# EAGLE design programmer (EAGLE 6.5.0)
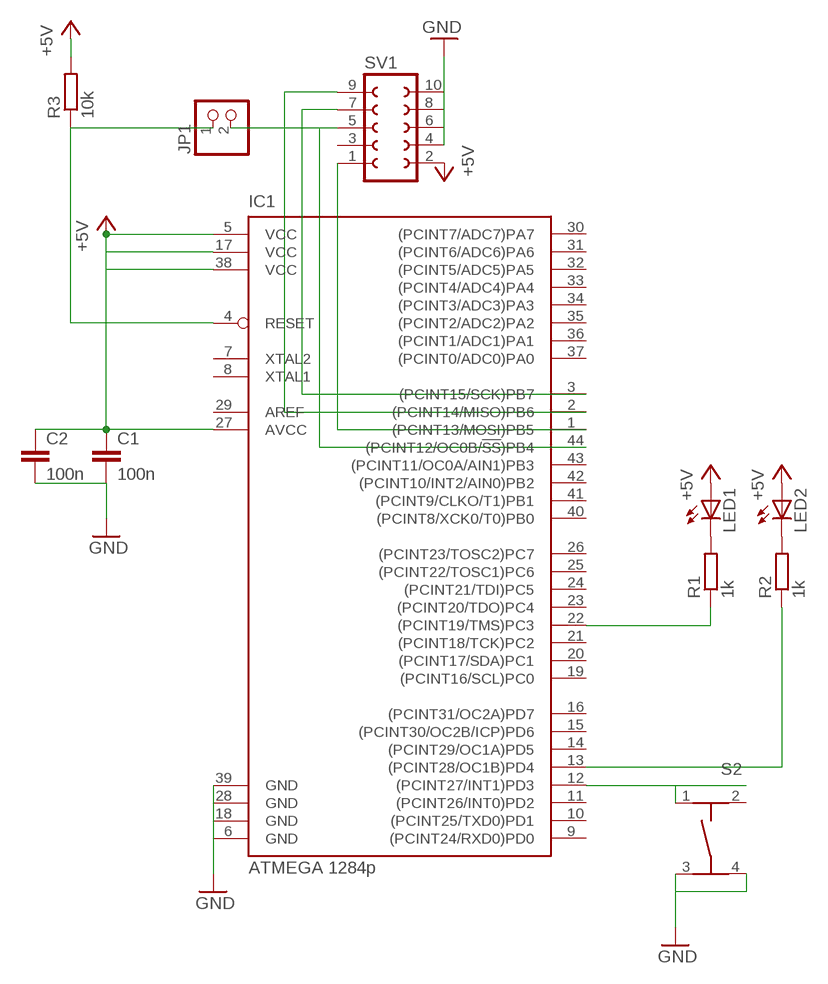
[diagram p0: schematic, sheet 1]

## Parts
C1  100n  C-EUC0603  [C0603]
C2  100n  C-EUC0603  [C0603]
IC1  ATMEGA 1284p  ATMEGA644A  [TQFP44]
JP1  PINHD-1X2  [1X02]
LED1  LED  [SMARTLED-TTW]
LED2  LED  [SMARTLED-TTW]
R1  1k  R-EU_R0603  [R0603]
R2  1k  R-EU_R0603  [R0603]
R3  10k  R-EU_R0603  [R0603]
S2  TASTER-9314_SMD  [TASTER-9314_SMD]
SV1  FE05-2W  [FE05-2W]

## Nets
+5V: C1.1 C2.1 IC1.5(VCC) IC1.17(VCC) IC1.27(AVCC) IC1.38(VCC) LED1.A@1(A) LED2.A@1(A) R3.2 SV1.2
GND: C1.2 C2.2 IC1.6(GND) IC1.18(GND) IC1.28(GND) IC1.39(GND) S2.3 S2.4 SV1.4 SV1.6 SV1.8 SV1.10
N$1: IC1.4(RESET) JP1.1 R3.1
N$2: IC1.44((PCINT12/OC0B/!SS!)PB4) JP1.2 SV1.5
N$3: LED1.C@1(C) R1.2
N$5: LED2.C@1(C) R2.2
N$6: IC1.3((PCINT15/SCK)PB7) SV1.7
N$7: IC1.1((PCINT13/MOSI)PB5) SV1.1
N$8: IC1.2((PCINT14/MISO)PB6) SV1.9
N$9: IC1.12((PCINT27/INT1)PD3) S2.1
N$12: IC1.22((PCINT19/TMS)PC3) R1.1
N$13: IC1.13((PCINT28/OC1B)PD4) R2.1
Unconnected: IC1.7(XTAL2) IC1.8(XTAL1) IC1.9((PCINT24/RXD0)PD0) IC1.10((PCINT25/TXD0)PD1) IC1.11((PCINT26/INT0)PD2) IC1.14((PCINT29/OC1A)PD5) IC1.15((PCINT30/OC2B/ICP)PD6) IC1.16((PCINT31/OC2A)PD7) IC1.19((PCINT16/SCL)PC0) IC1.20((PCINT17/SDA)PC1) IC1.21((PCINT18/TCK)PC2) IC1.23((PCINT20/TDO)PC4) IC1.24((PCINT21/TDI)PC5) IC1.25((PCINT22/TOSC1)PC6) IC1.26((PCINT23/TOSC2)PC7) IC1.29(AREF) IC1.30((PCINT7/ADC7)PA7) IC1.31((PCINT6/ADC6)PA6) IC1.32((PCINT5/ADC5)PA5) IC1.33((PCINT4/ADC4)PA4) IC1.34((PCINT3/ADC3)PA3) IC1.35((PCINT2/ADC2)PA2) IC1.36((PCINT1/ADC1)PA1) IC1.37((PCINT0/ADC0)PA0) IC1.40((PCINT8/XCK0/T0)PB0) IC1.41((PCINT9/CLKO/T1)PB1) IC1.42((PCINT10/INT2/AIN0)PB2) IC1.43((PCINT11/OC0A/AIN1)PB3) S2.2 SV1.3

## Library data of the parts
C1 C2 = rcl:C-EU: CAPACITOR, European symbol
IC1 = atmel:ATMEGA644: 8-bit Microcontroller with 64K Bytes In-System Programmable Flash Source: http://www.atmel.com/dyn/resources/prod_documents/doc2593.pdf; MPN: ATMEGA644PV-10AU; OC_FARNELL: 1455123; OC_NEWARK: 58M3748
JP1 = pinhead:PINHD-1X2: PIN HEADER
LED1 LED2 = led:LED: LED OSRAM: - CHIPLED LG R971, LG N971, LY N971, LG Q971, LY Q971, LO R971, LY R971 LH N974, LH R974 LS Q976, LO Q976, LY Q976 LO Q996 - Hyper CHIPLED LW Q18S LB Q993, LB Q99A, LB R99A - SideLED LS A670, LO A670, LY A670, LG A670, LP A670 LB A673, LV A673, LT A673, LW A673 LH A674 LY A675 LS A676, LA A676, LO A676, LY A676, LW A676 LS A679, LY A679, LG A679 - Hyper Micro SIDELED® LS Y876, LA Y876, LO Y876, LY Y876 LT Y87S - SmartLED LW L88C, LW L88S LB L89C, LB L89S, LG L890 LS L89K, LO L89K, LY L89K LS L896, LA L896, LO L896, LY L896 - TOPLED LS T670, LO T670, LY T670, LG T670, LP T670 LSG T670, LSP T670, LSY T670, LOP T670, LYG T670 LG T671, LOG T671, LSG T671 LB T673, LV T673, LT T673, LW T673 LH T674 LS T676, LA T676, LO T676, LY T676, LB T676, LH T676, LSB T676, LW T676 LB T67C, LV T67C, LT T67C, LS T67K, LO T67K, LY T67K, LW E67C LS E67B, LA E67B, LO E67B, LY E67B, LB E67C, LV E67C, LT E67C LW T67C LS T679, LY T679, LG T679 LS T770, LO T770, LY T770, LG T770, LP T770 LB T773, LV T773, LT T773, LW T773 LH T774 LS E675, LA E675, LY E675, LS T675 LS T776, LA T776, LO T776, LY T776, LB T776 LHGB T686 LT T68C, LB T68C - Hyper Mini TOPLED® LB M676 - Mini TOPLED Santana® LG M470 LS M47K, LO M47K, LY M47K Source: http://www.osram.convergy.de LUXEON: - LUMILED® LXK2-PW12-R00, LXK2-PW12-S00, LXK2-PW14-U00, LXK2-PW14-V00 LXK2-PM12-R00, LXK2-PM12-S00, LXK2-PM14-U00 LXK2-PE12-Q00, LXK2-PE12-R00, LXK2-PE12-S00, LXK2-PE14-T00, LXK2-PE14-U00 LXK2-PB12-K00, LXK2-PB12-L00, LXK2-PB12-M00, LXK2-PB14-N00, LXK2-PB14-P00, LXK2-PB14-Q00 LXK2-PR12-L00, LXK2-PR12-M00, LXK2-PR14-Q00, LXK2-PR14-R00 LXK2-PD12-Q00, LXK2-PD12-R00, LXK2-PD12-S00 LXK2-PH12-R00, LXK2-PH12-S00 LXK2-PL12-P00, LXK2-PL12-Q00, LXK2-PL12-R00 Source: www.luxeon.com KINGBRIGHT: KA-3528ASYC Source: www.kingbright.com
R1-R3 = rcl:R-EU_: RESISTOR, European symbol
S2 = Ergaenzung:TASTER-9314_SMD
SV1 = con-lsta:FE05-2W: FEMALE HEADER; OC_FARNELL: unknown; OC_NEWARK: unknown

## Board
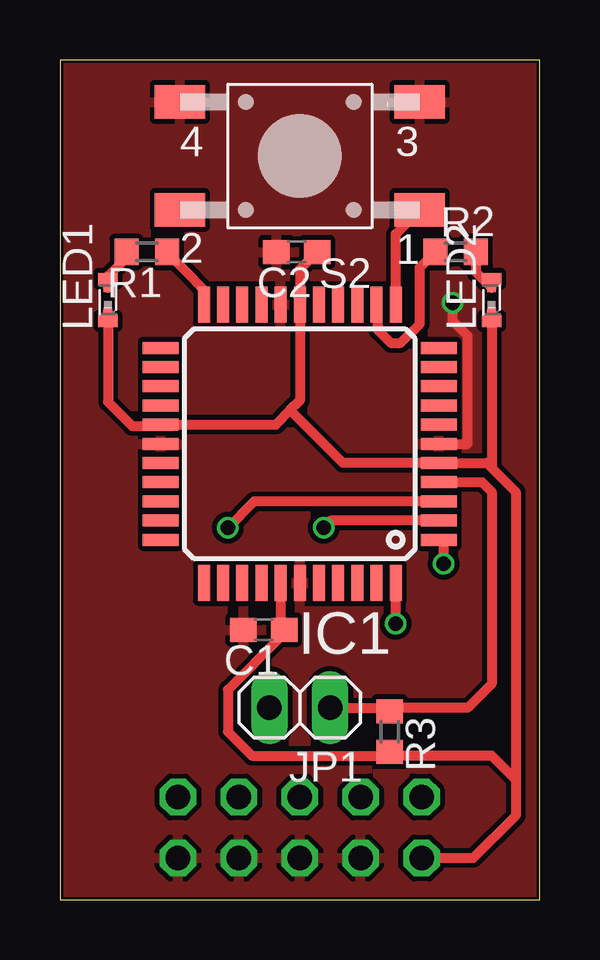
[diagram p1: board, top side]
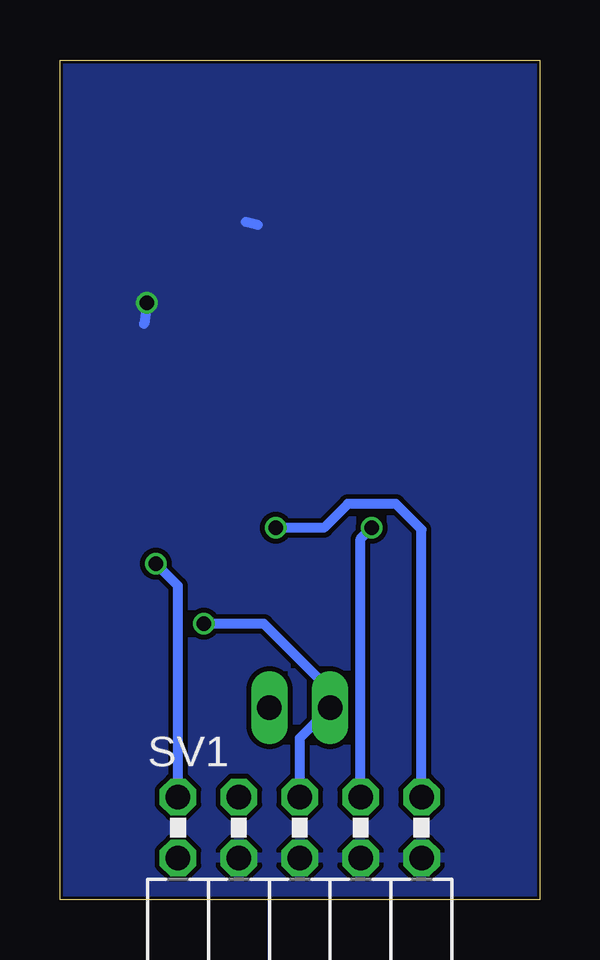
[diagram p2: board, bottom side, seen from below]

Size 20 x 35 mm. Coordinates in mm from the lower left corner, seen from the top.
Outline: 0,0 20,0 20,35 0,35 0,0
Copper layers (1*16): Top 0.035mm / dielectric 1.5mm / Bottom 0.035mm
Design rules "mohome *": minimum track width 5mil, minimum drill 12mil, track to track 8mil, track to pad 8mil, pad to pad 8mil, via to via 8mil, smd to smd 8mil, copper to edge 5mil, drill to drill 8mil, minimum pad ring 10mil, minimum via ring 6mil, stop-mask expansion 3mil, vias tented up to drill 0mil, thermal gap 8mil

### Footprints (pad centres in the part's own frame; a part is rotated, then mirrored left to right if it is on the bottom)
C0603 = smd 1.1 x 1: 1 -0.85,0; 2 0.85,0
TQFP44 = smd 1.5 x 0.5: 1 -5.8,4; 2 -5.8,3.2; 3 -5.8,2.4; 4 -5.8,1.6; 5 -5.8,0.8; 6 -5.8,0; 7 -5.8,-0.8; 8 -5.8,-1.6; 9 -5.8,-2.4; 10 -5.8,-3.2; 11 -5.8,-4; 23 5.8,-4; 24 5.8,-3.2; 25 5.8,-2.4; 26 5.8,-1.6; 27 5.8,-0.8; 28 5.8,0; 29 5.8,0.8; 30 5.8,1.6; 31 5.8,2.4; 32 5.8,3.2; 33 5.8,4 | smd 0.5 x 1.5: 12 -4,-5.8; 13 -3.2,-5.8; 14 -2.4,-5.8; 15 -1.6,-5.8; 16 -0.8,-5.8; 17 0,-5.8; 18 0.8,-5.8; 19 1.6,-5.8; 20 2.4,-5.8; 21 3.2,-5.8; 22 4,-5.8; 34 4,5.8; 35 3.2,5.8; 36 2.4,5.8; 37 1.6,5.8; 38 0.8,5.8; 39 0,5.8; 40 -0.8,5.8; 41 -1.6,5.8; 42 -2.4,5.8; 43 -3.2,5.8; 44 -4,5.8
1X02 = drill 1.016 long: 1 -1.27,0; 2 1.27,0
SMARTLED-TTW = smd 0.8 x 0.5: A 0,-0.875; C 0,0.875 | smd 0.35 x 0.35: A@1 0,-0.5; C@1 0,0.5
R0603 = smd 1 x 1.1: 1 -0.85,0; 2 0.85,0
TASTER-9314_SMD = smd 2.1 x 1.4: 1 -5,2.25; 2 5,2.25; 3 -5,-2.25; 4 5,-2.25
FE05-2W = drill 1.016 octagon: 1 -5.08,1.27; 2 -5.08,-1.27; 3 -2.54,1.27; 4 -2.54,-1.27; 5 0,1.27; 6 0,-1.27; 7 2.54,1.27; 8 2.54,-1.27; 9 5.08,1.27; 10 5.08,-1.27

### Placement (x,y rotation side)
C1  8.5,11.25 180 top
C2  9.88,27 180 top
IC1  10,19 180 top
JP1  10,8 180 top
LED1  2,25 0 top
LED2  18,25 0 top
R1  3.62,27 180 top
R2  16.5,27 0 top
R3  13.75,7 270 top
S2  10,31 180 top
SV1  10,3 0 bottom

### Tracks (layer width: path | path; a pad name or v marks a point on that pad's centre or on a via)
+5V
  Top 0.406: 18,18 17.8,18.2 IC1.5 11.8,18.2 9.6,20.4 | 19,5 19,17 18,18 | 19,5 19,3.5 17.23,1.73 SV1.2 | C1.1 9.2,11.15 IC1.38 9.2,10.95 7,8.75 7,7 8,6 13.85,6 R3.2 14.15,6 18,6 19,5 | IC1.27 4.75,19.8 | 4.75,19.8 9,19.8 9.6,20.4 | 9.6,20.4 10,20.8 IC1.17 10,26.27 C2.1 | LED1.A@1 2,20.75 3,19.75 4.7,19.75 4.75,19.8 | LED2.A@1 18,18
GND  (via drill 0.6)
  Top 0.406: IC1.6 17,19 17,23.5 16.38,24.12 v16.38,24.88
  Bottom 0.406: 11.75,28.12 12.25,28.25 | v16.38,24.88 16.5,24
  pour Top: 24,40 -1,40 -1,-2 24,-2
  pour Bottom: -1,40 21,40 21,-1 -1,-1
N$1
  Top 0.406: IC1.4 17.6,17.4 18,17 18,9 17,8 14.15,8 R3.1 13.85,8 JP1.1
N$2  (via drill 0.6)
  Top 0.406: v14,11.5 IC1.44
  Bottom 0.406: SV1.5 10,6.73 JP1.2 8.73,8.73 11.5,11.5 v14,11.5
N$3
  Top 0.406: LED1.C@1 2,26 3,27 R1.2
N$5
  Top 0.406: R2.2 17.35,26.15 LED2.C@1
N$6  (via drill 0.6)
  Top 0.406: IC1.3 8.1,16.6 v7,15.5
  Bottom 0.406: 6.84,15.34 v7,15.5 7.46,15.04 SV1.7
N$7  (via drill 0.6)
  Top 0.406: v16,14 16,14.8 IC1.1
  Bottom 0.406: SV1.1 15.08,13.08 v16,14
N$8  (via drill 0.6)
  Top 0.406: IC1.2 11.3,15.8 v11,15.5
  Bottom 0.406: v11,15.5 9,15.5 8,16.5 6,16.5 4.92,15.42 SV1.9
N$9
  Top 0.406: IC1.12 14,27.75 S2.1
N$12
  Top 0.406: IC1.22 6,25.4 R1.1
N$13
  Top 0.406: IC1.13 13.25,23.75 13.8,23.2 14.2,23.2 15,24 15,26.35 R2.1